# Altium schematic sheet GSM防火防盗.SchDoc
size A4
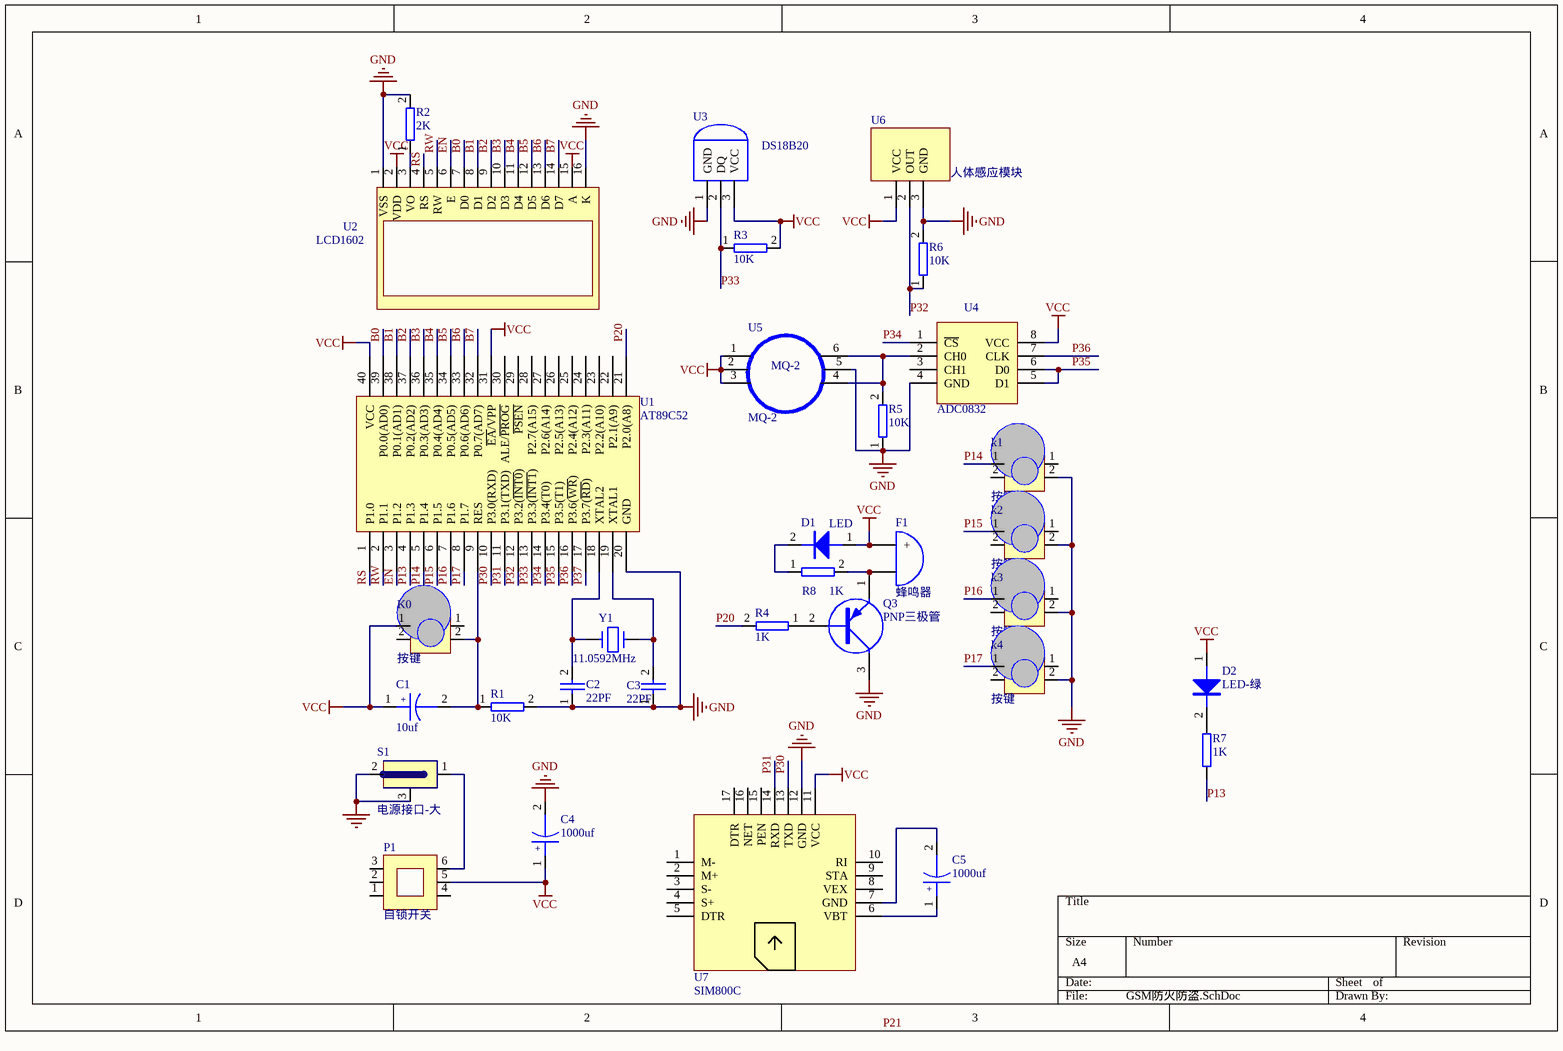
[diagram p0: GSM防火防盗.SchDoc]

## Parts
C1  10uf  [电容-电解10UF]
C2  22PF  [电容-瓷片]
C3  22PF  [电容-瓷片]
C4  1000uf  [电容-电解1000UF - 25V]
C5  1000uf  [电容-电解1000UF - 25V]
D1  LED  [LED]
D2  LED-绿  [LED-5MM]
F1  蜂鸣器  [蜂鸣器]
K0  按键  [按键]
k1  按键  [按键]
k2  按键  [按键]
k3  按键  [按键]
k4  按键  [按键]
P1  自锁开关  [自锁开关]
Q3  PNP三极管  [三极管]
R1  10K  [电阻]
R2  2K  [电阻]
R3  10K  [电阻]
R4  1K  [电阻]
R5  10K  [电阻]
R6  10K  [电阻]
R7  1K  [电阻]
R8  1K  [电阻]
S1  电源接口-大  [电源座-大]
U1  AT89C52  [底座40P]
U2  LCD1602  [LCD1602]
U3  DS18B20  [三极管]
U4  ADC0832  [底座8P]
U5  MQ-2  [MQ-2]
U6  人体感应模块  [人体感应模块]
U7  SIM800C  [SIM800C]
Y1  11.0592MHz  [晶振]

## Nets
GND: C2.1 C3.1 C4.2 k1.2 k2.2 k3.2 k4.2 Q3.3(C) R1.2 R2.2 R5.1 R6.2 S1.2 S1.3 U1.20(GND) U2.1(VSS) U2.16(K) U3.1(GND) U4.4(GND) U5.5 U6.3(GND) U7.12(GND)
VCC: C1.1 C4.1 D1.1 D2.1 F1.1(+) K0.1 P1.5 R3.2 U1.31(~{EA}/VPP) U1.40(VCC) U2.2(VDD) U2.15(A) U3.3(VCC) U4.8(VCC) U5.1 U5.2 U5.3 U6.1(VCC) U7.11(VCC)
B0: U1.39(P0.0(AD0)) U2.7(D0)
B1: U1.38(P0.1(AD1)) U2.8(D1)
B2: U1.37(P0.2(AD2)) U2.9(D2)
B3: U1.36(P0.3(AD3)) U2.10(D3)
B4: U1.35(P0.4(AD4)) U2.11(D4)
B5: U1.34(P0.5(AD5)) U2.12(D5)
B6: U1.33(P0.6(AD6)) U2.13(D6)
B7: U1.32(P0.7(AD7)) U2.14(D7)
EN: U1.3(P1.2) U2.6(E)
P13: R7.1 U1.4(P1.3)
P14: k1.1 U1.5(P1.4)
P15: k2.1 U1.6(P1.5)
P16: k3.1 U1.7(P1.6)
P17: k4.1 U1.8(P1.7)
P20: R4.2 U1.21(P2.0(A8))
P30: U1.10(P3.0(RXD)) U7.13(TXD)
P31: U1.11(P3.1(TXD)) U7.14(RXD)
P32: R6.1 U1.12(P3.2(~{INT0})) U6.2(OUT)
P33: R3.1 U1.13(P3.3(~{INT1})) U3.2(DQ)
P34: U1.14(P3.4(T0)) U4.1(~{CS})
P35: U1.15(P3.5(T1)) U4.5(D1) U4.6(D0)
P36: U1.16(P3.6(~{WR})) U4.7(CLK)
P37: U1.17(P3.7(~{RD}))
RS: U1.1(P1.0) U2.4(RS)
RW: U1.2(P1.1) U2.5(RW)
NetC1_2: C1.2 K0.2 R1.1 U1.9(RES)
NetC2_2: C2.2 U1.18(XTAL2) Y1.1
NetC3_2: C3.2 U1.19(XTAL1) Y1.2
NetC5_1: C5.1 U7.6(VBT)
NetC5_2: C5.2 U7.7(GND)
NetD1_2: D1.2 R8.1
NetD2_2: D2.2 R7.2
NetF1_2: F1.2(B) Q3.1(E) R8.2
NetP1_6: P1.6 S1.1
NetQ3_2: Q3.2(B) R4.1
NetR2_1: R2.1 U2.3(VO)
NetR5_2: R5.2 U4.2(CH0) U5.4 U5.6

Not connected (* = marked no-connect by the designer): P1 1 2 3 4; U1 22(P2.1(A9)) 23(P2.2(A10)) 24(P2.3(A11)) 25(P2.4(A12)) 26(P2.5(A13)) 27(P2.6(A14)) 28(P2.7(A15)) 29(~{PSEN}) 30(ALE/~{PROG}); U4 3(CH1); U7 1(M-) 2(M+) 3(S-) 4(S+) 5(DTR) 8(VEX) 9(STA) 10(RI) 15(PEN) 16(NET) 17(DTR)

## Notes on the sheet
- Labels drawn without touching a wire or pin: P21
- (in symbol 电解电容) +
- (in symbol 电解电容-1000uf-25v) +

## Library data of the parts
C1 = 电解电容
C2 C3 = 瓷片电容
C4 C5 = 电解电容-1000uf-25v
D2 = LED-5MM
R1-R8 = 电阻-定值
U1 = STC89C52
Y1 = 晶振